# EAGLE design oz7fox (EAGLE 6.4)
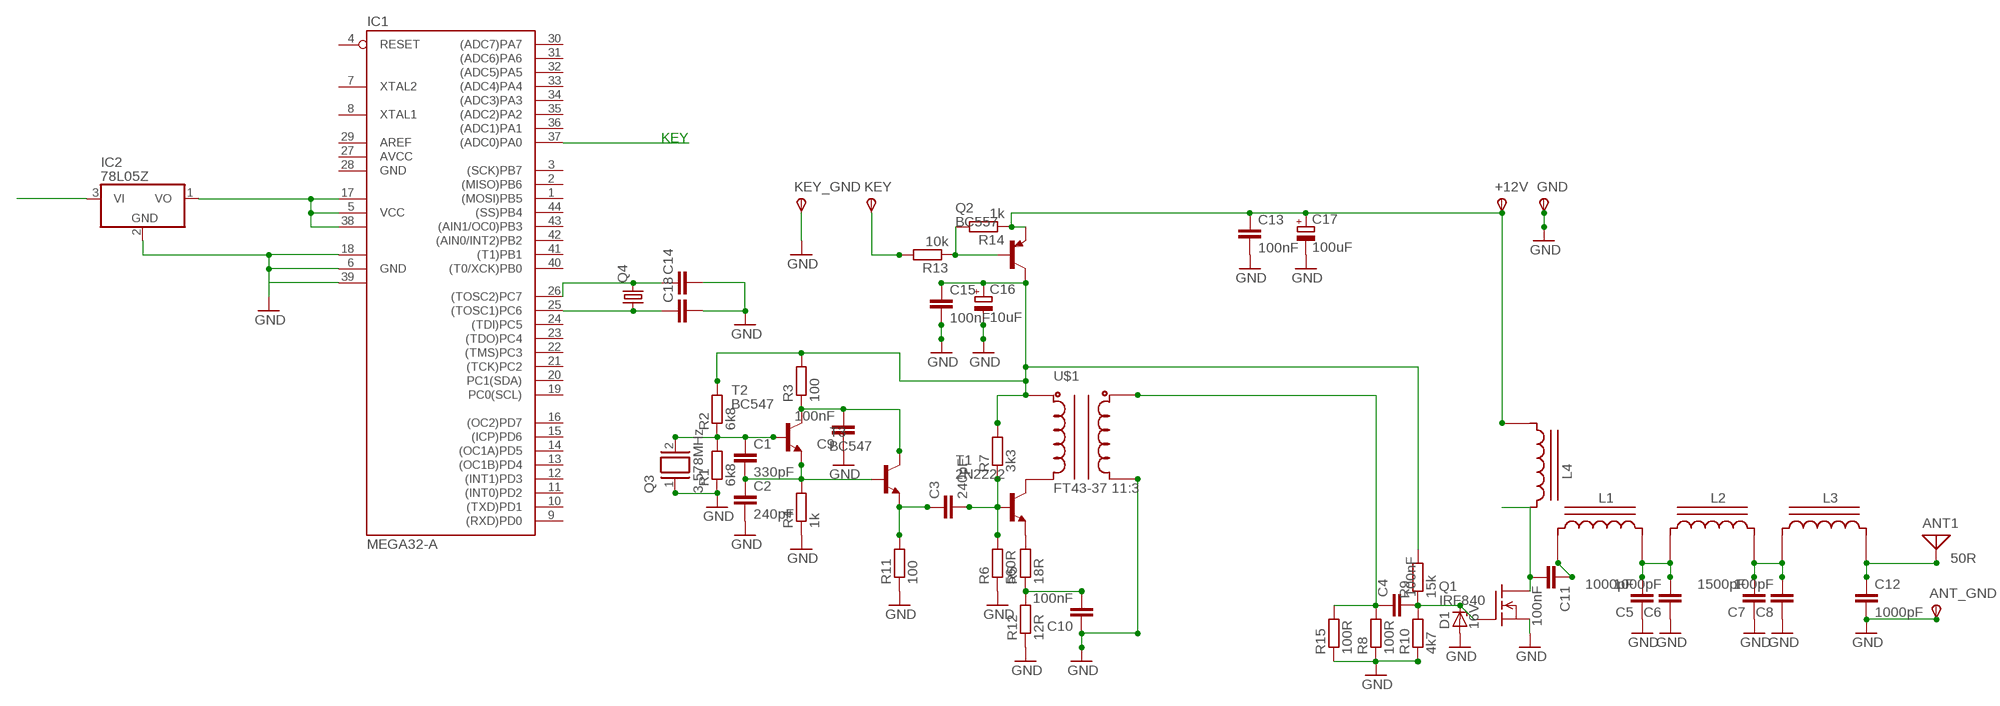
[diagram p0: schematic, sheet 1]

## Parts
+12V  TPSPAD1-20  [P1-20]
ANT1  50R  ANTENNA  [PAD-01]
ANT_GND  TPSPAD1-20  [P1-20]
C1  330pF  C-EU150-054X183  [C150-054X183]
C2  240pF  C-EU150-054X183  [C150-054X183]
C3  240pF  C-EU150-054X183  [C150-054X183]
C4  100nF  C-EU150-054X183  [C150-054X183]
C5  1000pF  C-EU150-054X183  [C150-054X183]
C6  1000pF  C-EU150-054X183  [C150-054X183]
C7  1500pF  C-EU150-054X183  [C150-054X183]
C8  100pF  C-EU150-054X183  [C150-054X183]
C9  100nF  C-EU050-025X075  [C050-025X075]
C10  100nF  C-EU050-025X075  [C050-025X075]
C11  100nF  C-EU150-054X183  [C150-054X183]
C12  1000pF  C-EU150-054X183  [C150-054X183]
C13  100nF  C-EU050-025X075  [C050-025X075]
C14  C5/2.5  [C5B2.5]
C15  100nF  C-EU050-025X075  [C050-025X075]
C16  10uF  CPOL-EUE5-13  [E5-13]
C17  100uF  CPOL-EUE5-13  [E5-13]
C18  C5/2.5  [C5B2.5]
D1  16V  ZENER-DIODEZD-12.5  [ZDIO12.5]
GND  TPSPAD1-20  [P1-20]
IC1  MEGA32-A  [TQFP44]
IC2  78L05Z  [TO92]
KEY  TPSPAD1-20  [P1-20]
KEY_GND  TPSPAD1-20  [P1-20]
L1  T37_INDUCTOR  [T37_INDUCTOR]
L2  T37_INDUCTOR  [T37_INDUCTOR]
L3  T37_INDUCTOR  [T37_INDUCTOR]
L4  T37-2 16t  T37_INDUCTOR  [T37_INDUCTOR]
Q1  IRF840  [TO220]
Q2  BC557  [TO92]
Q3  3,578MHz  XTAL  [Q]
Q4  CRYSTALTC26V  [TC26V]
R1  6k8  R-EU_0207/12  [0207/12]
R2  6k8  R-EU_0207/10  [0207/10]
R3  100  R-EU_0207/12  [0207/12]
R4  1k  R-EU_0207/12  [0207/12]
R5  18R  R-EU_0207/12  [0207/12]
R6  560R  R-EU_0207/12  [0207/12]
R7  3k3  R-EU_0207/12  [0207/12]
R8  100R  R-EU_0207/12  [0207/12]
R9  15k  R-EU_0207/12  [0207/12]
R10  4k7  R-EU_0207/12  [0207/12]
R11  100  R-EU_0207/12  [0207/12]
R12  12R  R-EU_0207/12  [0207/12]
R13  10k  R-EU_0207/12  [0207/12]
R14  1k  R-EU_0207/12  [0207/12]
R15  100R  R-EU_0207/12  [0207/12]
T1  2N2222  [TO18]
T2  BC547  [TO92]
T3  BC547  [TO92]
U$1  FT43-37 11:3  T37_TRANSFORMER  [T37_TRANSFORMER]

## Nets
12V: +12V.TP(PP) C13.1 C17.+ IC2.3(VI) L4.CB Q2.1(E) R14.1
GND: ANT_GND.TP(PP) C2.2 C5.1 C6.1 C7.1 C8.1 C9.1 C10.1 C12.2 C13.2 C14.2 C15.2 C16.- C17.- C18.2 D1.A GND.TP(PP) IC1.6(GND) IC1.18(GND1) IC1.39(GND2) IC2.2(GND) KEY_GND.TP(PP) Q1.3(S) Q3.1 R1.1 R4.1 R6.1 R8.1 R10.1 R11.1 R12.1 R15.1 U$1.C2A
KEY: IC1.37((ADC0)PA0) KEY.TP(PP) R13.2
N$1: C1.2 C2.1 R4.2 T2.1(E) T3.2(B)
N$2: C11.1 L1.CB
N$3: C1.1 Q3.2 R1.2 R2.1 T2.2(B)
N$4: C9.2 R3.1 T2.3(C) T3.3(C)
N$5: C15.1 C16.+ Q2.3(C) R2.2 R3.2 R7.2 R9.2 U$1.C1B
N$6: C3.1 R11.2 T3.1(E)
N$7: C11.2 L4.CA Q1.2(D)
N$8: C3.2 R6.2 R7.1 T1.2(B)
N$9: R5.2 T1.1(E)
N$10: C10.2 R5.1 R12.2
N$11: T1.3(C) U$1.C1A
N$12: C5.2 C6.2 L1.CA L2.CB
N$13: IC1.5(VCC) IC1.17(VCC1) IC1.38(VCC2) IC2.1(VO)
N$14: C7.2 C8.2 L2.CA L3.CB
N$15: C18.1 IC1.25((TOSC1)PC6) Q4.1
N$16: ANT1.1 C12.1 L3.CA
N$17: C4.1 R8.2 R15.2 U$1.C2B
N$18: C4.2 D1.C Q1.1(G) R9.1 R10.2
N$19: C14.1 IC1.26((TOSC2)PC7) Q4.2
N$25: Q2.2(B) R13.1 R14.2
Unconnected: IC1.1((MOSI)PB5) IC1.2((MISO)PB6) IC1.3((SCK)PB7) IC1.4(RESET) IC1.7(XTAL2) IC1.8(XTAL1) IC1.9((RXD)PD0) IC1.10((TXD)PD1) IC1.11((INT0)PD2) IC1.12((INT1)PD3) IC1.13((OC1B)PD4) IC1.14((OC1A)PD5) IC1.15((ICP)PD6) IC1.16((OC2)PD7) IC1.19(PC0(SCL)) IC1.20(PC1(SDA)) IC1.21((TCK)PC2) IC1.22((TMS)PC3) IC1.23((TDO)PC4) IC1.24((TDI)PC5) IC1.29(AREF) IC1.30((ADC7)PA7) IC1.31((ADC6)PA6) IC1.32((ADC5)PA5) IC1.33((ADC4)PA4) IC1.34((ADC3)PA3) IC1.35((ADC2)PA2) IC1.36((ADC1)PA1) IC1.40((T0/XCK)PB0) IC1.41((T1)PB1) IC1.42((AIN0/INT2)PB2) IC1.43((AIN1/OC0)PB3) IC1.44((SS)PB4)

## Notes on the sheet
- KEY

## Power pins joined to a net without a drawn wire
AVCC: IC1.27(AVCC)
GND: IC1.28(GND)

## Library data of the parts
+12V ANT_GND GND KEY KEY_GND = testpad:TPS: TEST PIN
ANT1 = discrete:ANTENNA: Antenna
C1-C13 C15 = resistor:C-EU: CAPACITOR, European symbol
C14 C18 = capacitor-wima:C: CAPACITOR naming: grid - package width
C16 C17 = resistor:CPOL-EU: POLARIZED CAPACITOR, European symbol
D1 = diode:ZENER-DIODE: Z-Diode
IC1 = atmel:MEGA32: MICROCONTROLLER 32 Kbytes FLASH 2 Kbytes SRAM 1 Kbytes EEPROM USART 8-channel 10 bit ADC Source: www.atmel.com .. doc2503.pdf; MPN: ATMEGA32-16AU; OC_FARNELL: 9171274; OC_NEWARK: 69K6677
IC2 = linear:78*: Positive VOLTAGE REGULATOR Source: http://cache.national.com/ds/LM/LM78L05.pdf http://www.fairchildsemi.com/ds/LM/LM7805.pdf
L1-L4 = toroid:T37_INDUCTOR: Inductor wound on a T37 Toroid
Q1 = transistor-fet:IRF840: N-Channel Enhancement MOSFET (HEXFET); 500V; 8A; 0,85Ohm
Q2 = transistor-pnp:BC557: PNP Transistor
Q3 = special:XTAL: CRYSTAL
Q4 = crystal:CRYSTAL: CRYSTAL; OC_FARNELL: unknown; OC_NEWARK: unknown
R1-R15 = resistor:R-EU_: RESISTOR, European symbol
T1 = transistor-neu-to92:2N2222: NPN TRANSISTOR
T2 T3 = transistor:BC547: NPN TRANSISTOR
U$1 = toroid:T37_TRANSFORMER: Transformer wound on a T37 Toroid

## Board
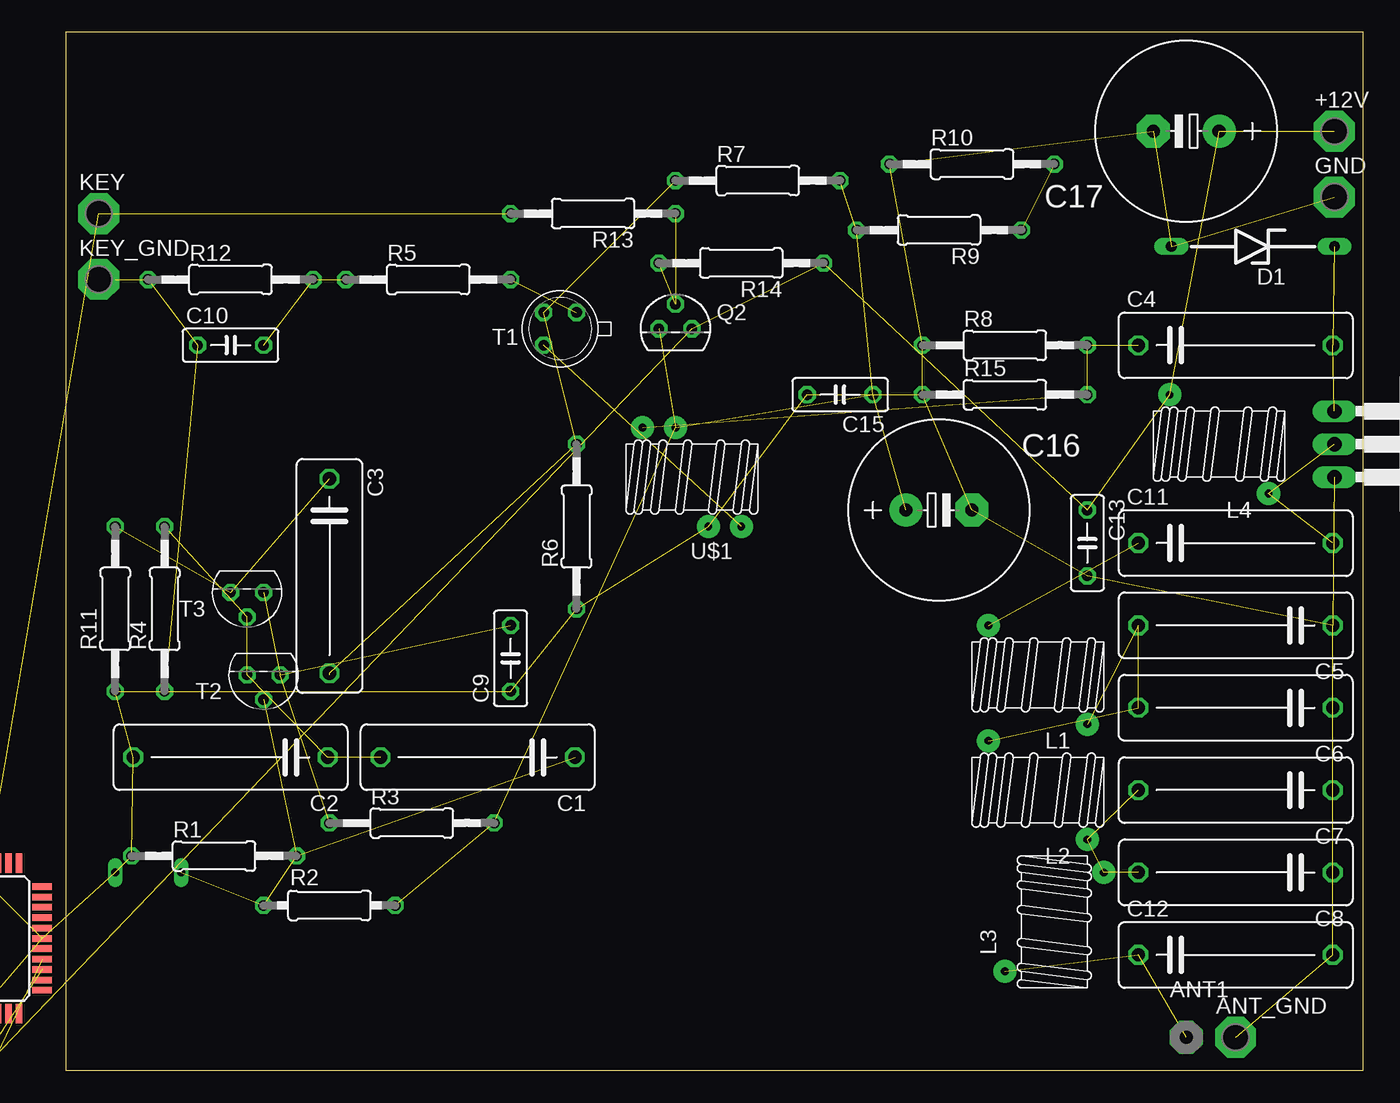
[diagram p1: board, top side]
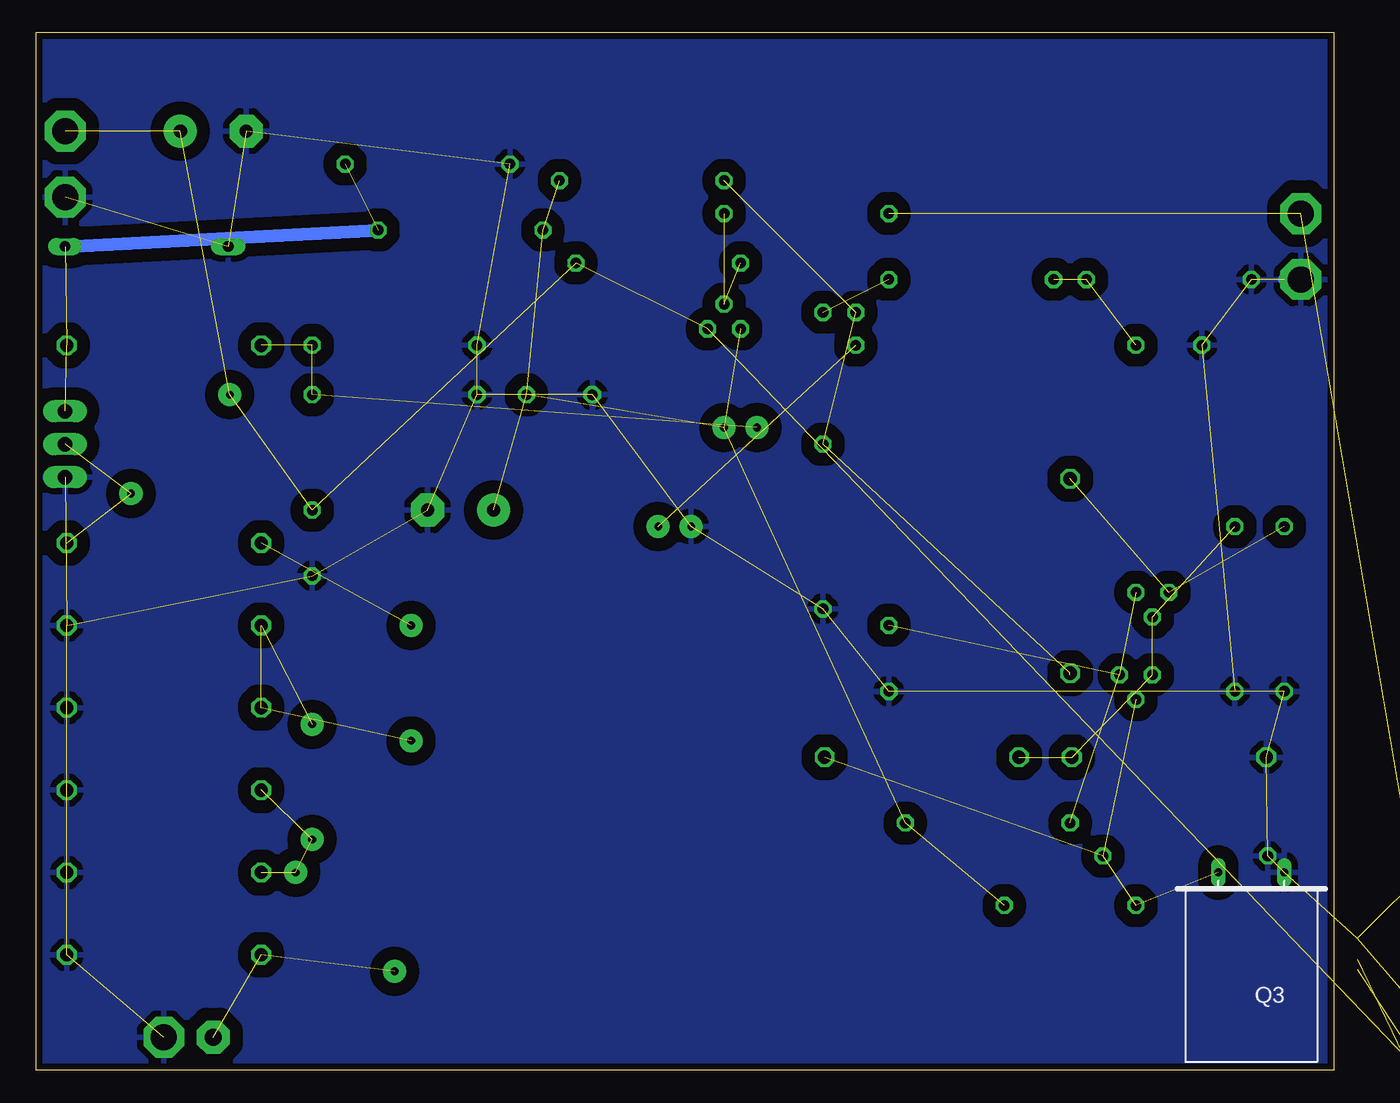
[diagram p2: board, bottom side, seen from below]

Size 100 x 80 mm. Coordinates in mm from the lower left corner, seen from the top.
Outline: 0,0 100,0 100,80 0,80 0,0
Copper layers (1*16): Top 0.035mm / dielectric 1.5mm / Bottom 0.035mm
Design rules "JOTA": minimum track width 1mm, minimum drill 0.8mm, track to track 1mm, track to pad 0.5mm, pad to pad 0.5mm, via to via 0.5mm, smd to smd 0.25mm, copper to edge 0.5mm, drill to drill 1mm, minimum pad ring 0.25mm, minimum via ring 0.5mm, stop-mask expansion 4mil, vias tented up to drill 0mil, thermal gap 0.5mm

### Footprints (pad centres in the part's own frame; a part is rotated, then mirrored left to right if it is on the bottom)
P1-20 = drill 2.007 pad 3.15 octagon: TP 0,0
PAD-01 = drill 1.321 pad 2.54 octagon: 1 0,0
C150-054X183 = drill 1.016 octagon: 1 -7.493,0; 2 7.493,0
C050-025X075 = drill 0.813 octagon: 1 -2.54,0; 2 2.54,0
C5B2.5 = drill 0.813 pad 1.6 octagon: 1 -2.54,0; 2 2.54,0
E5-13 = drill 1.016 pad 2.54: + -2.54,0 | drill 1.016 pad 2.54 octagon: - 2.54,0
ZDIO12.5 = drill 0.813 long: A 6.223,0; C -6.35,0
TQFP44 = smd 1.5 x 0.5: 1 -5.8,4; 2 -5.8,3.2; 3 -5.8,2.4; 4 -5.8,1.6; 5 -5.8,0.8; 6 -5.8,0; 7 -5.8,-0.8; 8 -5.8,-1.6; 9 -5.8,-2.4; 10 -5.8,-3.2; 11 -5.8,-4; 23 5.8,-4; 24 5.8,-3.2; 25 5.8,-2.4; 26 5.8,-1.6; 27 5.8,-0.8; 28 5.8,0; 29 5.8,0.8; 30 5.8,1.6; 31 5.8,2.4; 32 5.8,3.2; 33 5.8,4 | smd 0.5 x 1.5: 12 -4,-5.8; 13 -3.2,-5.8; 14 -2.4,-5.8; 15 -1.6,-5.8; 16 -0.8,-5.8; 17 0,-5.8; 18 0.8,-5.8; 19 1.6,-5.8; 20 2.4,-5.8; 21 3.2,-5.8; 22 4,-5.8; 34 4,5.8; 35 3.2,5.8; 36 2.4,5.8; 37 1.6,5.8; 38 0.8,5.8; 39 0,5.8; 40 -0.8,5.8; 41 -1.6,5.8; 42 -2.4,5.8; 43 -3.2,5.8; 44 -4,5.8
TO92 = drill 0.813 octagon: 1 -1.27,0; 2 0,1.905; 3 1.27,0
T37_INDUCTOR = drill 0.6 pad 1.778: CA -3.81,-3.81; CB 3.81,3.81
TO220 = drill 1.118 long: 1 -2.54,-6.35; 2 0,-6.35; 3 2.54,-6.35 | hole 3.302: 0,11.176
TO92' = drill 0.813 octagon: 1 1.27,0; 2 0,1.905; 3 -1.27,0
Q = drill 0.61 long: 1 -2.54,-7.62; 2 2.54,-7.62
TC26V = drill 0.813: 1 -1.27,0; 2 1.27,0
0207/12 = drill 0.813 octagon: 1 -6.35,0; 2 6.35,0
0207/10 = drill 0.813 octagon: 1 -5.08,0; 2 5.08,0
TO18 = drill 0.813 octagon: 1 -1.27,-1.27; 2 1.27,-1.27; 3 1.27,1.27
T37_TRANSFORMER = drill 0.6 pad 1.778: C1A -3.81,-3.81; C1B 3.81,1.27; C2A -3.81,-1.27; C2B 3.81,3.81

### Placement (x,y rotation side)
+12V  97.79,72.39 0 top
ANT1  86.36,2.54 0 top
ANT_GND  90.17,2.54 0 top
C1  31.75,24.13 180 top
C2  12.7,24.13 180 top
C3  20.32,38.1 270 top
C4  90.17,55.88 0 top
C5  90.17,34.29 180 top
C6  90.17,27.94 180 top
C7  90.17,21.59 180 top
C8  90.17,15.24 180 top
C9  34.29,31.75 90 top
C10  12.7,55.88 0 top
C11  90.17,40.64 0 top
C12  90.17,8.89 0 top
C13  78.74,40.64 270 top
C14  -10.16,-13.97 0 top  (outside the outline)
C15  59.69,52.07 180 top
C16  67.31,43.18 0 top
C17  86.36,72.39 180 top
C18  -10.16,-19.05 0 top  (outside the outline)
D1  91.44,63.5 180 top
GND  97.79,67.31 0 top
IC1  -7.62,10.16 0 top
IC2  -11.43,-3.81 0 top  (outside the outline)
KEY  2.54,66.04 0 top
KEY_GND  2.54,60.96 0 top
L1  74.93,30.48 90 top
L2  74.93,21.59 90 top
L3  76.2,11.43 0 top
L4  88.9,48.26 90 top
Q1  104.14,48.26 270 top
Q2  BC557  [TO92']  46.99,57.15 0 top
Q3  6.35,7.62 180 bottom
Q4  -11.43,-8.89 0 top  (outside the outline)
R1  11.43,16.51 0 top
R2  20.32,12.7 0 top
R3  26.67,19.05 0 top
R4  7.62,35.56 90 top
R5  27.94,60.96 0 top
R6  39.37,41.91 90 top
R7  53.34,68.58 0 top
R8  72.39,55.88 0 top
R9  67.31,64.77 180 top
R10  69.85,69.85 0 top
R11  3.81,35.56 90 top
R12  12.7,60.96 0 top
R13  40.64,66.04 180 top
R14  52.07,62.23 180 top
R15  72.39,52.07 0 top
T1  38.1,57.15 180 top
T2  BC547  [TO92']  15.24,30.48 180 top
T3  BC547  [TO92']  13.97,36.83 180 top
U$1  48.26,45.72 90 top

### Tracks (layer width: path | path; a pad name or v marks a point on that pad's centre or on a via)
12V  (6 unrouted)
GND  (33 unrouted)
  Bottom 1: KEY_GND.TP 2.74,60.76 | KEY_GND.TP 2.74,60.76 | R12.1 | R12.1 | 3.81,60.96 KEY_GND.TP | R12.1 | 3.81,60.96 KEY_GND.TP | 3.81,60.96 KEY_GND.TP | KEY_GND.TP 2.74,60.76 | R12.1 | 3.81,60.96 KEY_GND.TP | KEY_GND.TP 2.74,60.76 | 3.81,60.96 KEY_GND.TP | KEY_GND.TP 2.74,60.76 | KEY_GND.TP 2.74,60.76 | 3.81,60.96 KEY_GND.TP | R12.1 | 3.81,60.96 KEY_GND.TP | 3.81,60.96 KEY_GND.TP | KEY_GND.TP 2.74,60.76 | R12.1 | KEY_GND.TP 2.74,60.76 | R6.1 | R6.1 | 3.81,60.96 KEY_GND.TP | KEY_GND.TP 2.74,60.76 | 3.81,60.96 KEY_GND.TP
  pour Bottom: 0,80.01 100.33,80.01 100.33,0 0,0
KEY  (2 unrouted)
N$1  (4 unrouted)
N$2  (1 unrouted)
N$3  (4 unrouted)
N$4  (3 unrouted)
N$5  (7 unrouted)
N$6  (2 unrouted)
N$7  (2 unrouted)
  Bottom 1: 97.79,40.64 C11.2 97.79,40.64
N$8  (4 unrouted)
  Bottom 1: C3.2 20.32,30.48
N$9  (1 unrouted)
N$10  (2 unrouted)
N$11  (1 unrouted)
N$12  (3 unrouted)
N$13  (3 unrouted)
N$14  (3 unrouted)
N$15  (2 unrouted)
N$16  (2 unrouted)
N$17  (3 unrouted)
N$18  (3 unrouted)
  Bottom 1: D1.C R9.1
N$19  (2 unrouted)
N$25  (2 unrouted)